# EAGLE design untitled1 (EAGLE 6.1)
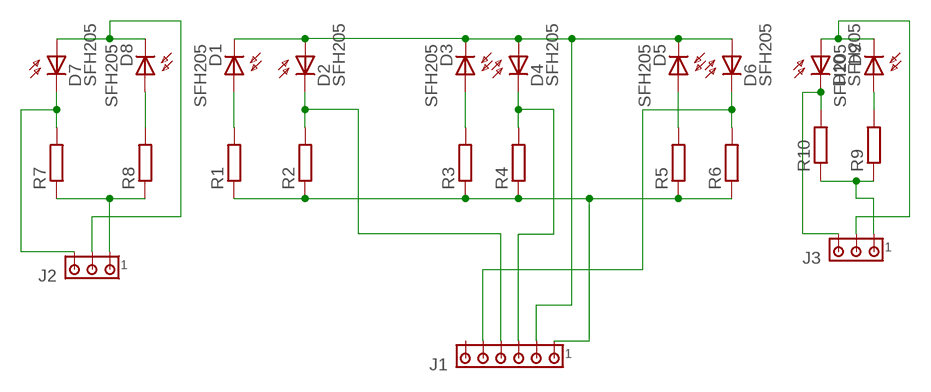
[diagram p0: schematic, sheet 1]

## Parts
D1  SFH205  [SFH205]
D2  SFH205  [SFH205]
D3  SFH205  [SFH205]
D4  SFH205  [SFH205]
D5  SFH205  [SFH205]
D6  SFH205  [SFH205]
D7  SFH205  [SFH205]
D8  SFH205  [SFH205]
D9  SFH205  [SFH205]
D10  SFH205  [SFH205]
J1  MTA06-100  [10X06MTA]
J2  MTA03-100  [10X03MTA]
J3  MTA03-100  [10X03MTA]
R1  R-EU_0207/10  [0207/10]
R2  R-EU_0207/10  [0207/10]
R3  R-EU_0207/10  [0207/10]
R4  R-EU_0207/10  [0207/10]
R5  R-EU_0207/10  [0207/10]
R6  R-EU_0207/10  [0207/10]
R7  R-EU_0207/10  [0207/10]
R8  R-EU_0207/10  [0207/10]
R9  R-EU_0207/10  [0207/10]
R10  R-EU_0207/10  [0207/10]

## Nets
N$1: D1.A R1.2
N$2: D9.K(C) D10.A J3.2
N$3: D3.A R3.2
N$4: D4.K(C) J1.4 R4.2
N$5: D5.A R5.2
N$6: D6.K(C) J1.2 R6.2
N$7: J1.6 R1.1 R2.1 R3.1 R4.1 R5.1 R6.1
N$8: D1.K(C) D2.A D3.K(C) D4.A D5.K(C) D6.A J1.5
N$9: D7.K(C) J2.3 R7.2
N$10: D7.A D8.K(C) J2.2
N$11: D2.K(C) J1.3 R2.2
N$12: D8.A R8.2
N$13: D10.K(C) J3.3 R10.2
N$14: D9.A R9.2
N$15: J2.1 R7.1 R8.1
N$16: J3.1 R9.1 R10.1
Unconnected: J1.1

## Library data of the parts
D1-D10 = opto-trans-siemens:SFH205: PHOTO DIODE; OC_FARNELL: unknown; OC_NEWARK: unknown
J1 = con-amp:MTA06-100: AMP connector
J2 J3 = con-amp:MTA03-100: AMP connector
R1-R10 = rcl:R-EU_: RESISTOR, European symbol

## Board
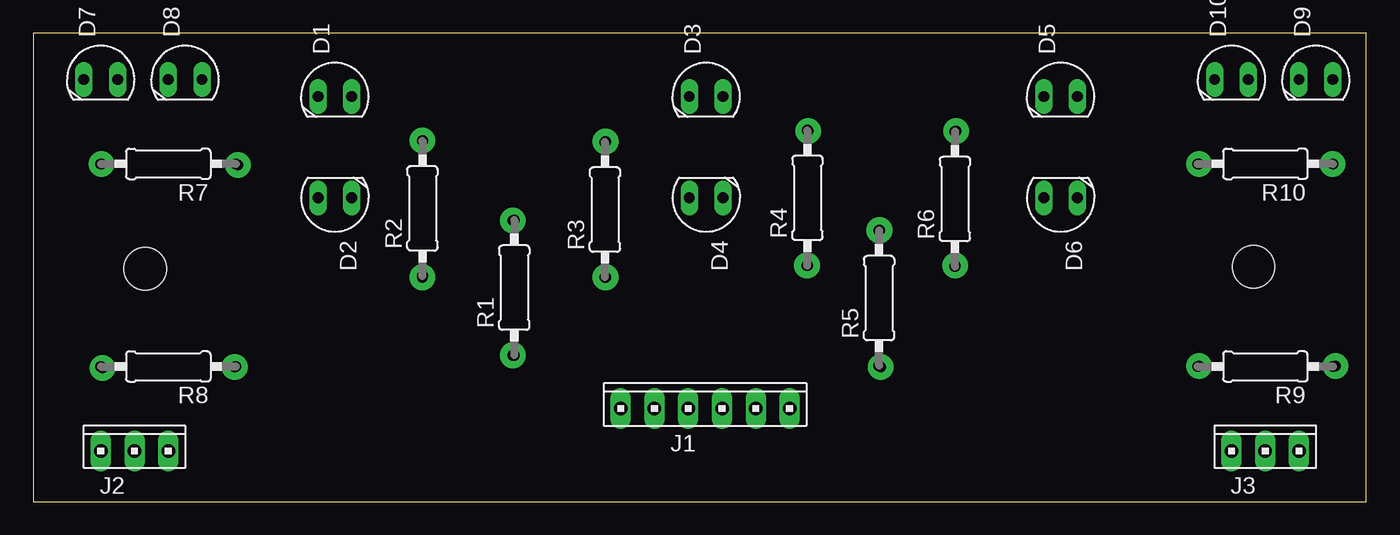
[diagram p1: board, top side]
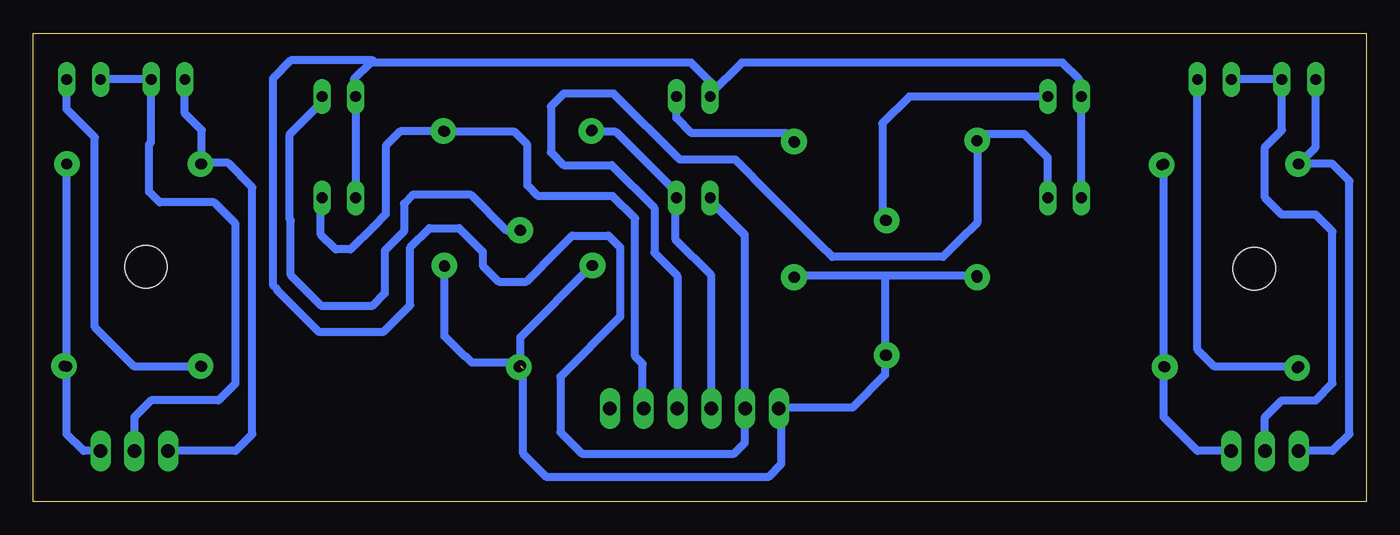
[diagram p2: board, bottom side, seen from below]

Size 100.31 x 35.23 mm. Coordinates in mm from the lower left corner, seen from the top.
Outline: 0,0 100.31,0 100.31,35.23 0,35.23 0,0
Copper layers (1*16): Top 0.035mm / dielectric 1.5mm / Bottom 0.035mm
Design rules: minimum track width 10mil, minimum drill 24mil, track to track 8mil, track to pad 8mil, pad to pad 8mil, via to via 8mil, smd to smd 8mil, copper to edge 40mil, drill to drill 8mil, minimum pad ring 10mil, minimum via ring 8mil, stop-mask expansion 4mil, vias tented up to drill 0mil, thermal gap 10mil
Holes 3.2 mm at 91.83,17.68 8.42,17.52

### Footprints (pad centres in the part's own frame; a part is rotated, then mirrored left to right if it is on the bottom)
SFH205 = drill 0.813 long: A 0,-1.27; K 0,1.27
10X06MTA = drill 1.016 long: 1 6.35,0; 2 3.81,0; 3 1.27,0; 4 -1.27,0; 5 -3.81,0; 6 -6.35,0
10X03MTA = drill 1.016 long: 1 2.54,0; 2 0,0; 3 -2.54,0
0207/10 = drill 0.813 octagon: 1 -5.08,0; 2 5.08,0

### Placement (x,y rotation side)
D1  22.7,30.46 90 top
D2  22.7,22.84 270 top
D3  50.64,30.46 90 top
D4  50.64,22.84 270 top
D5  77.31,30.46 90 top
D6  77.31,22.84 270 top
D7  5.08,31.75 90 top
D8  11.43,31.75 90 top
D9  96.52,31.75 90 top
D10  90.17,31.75 90 top
J1  50.56,6.99 0 top
J2  7.62,3.81 0 top
J3  92.71,3.81 0 top
R1  36.2,16.09 90 top
R2  29.29,22.06 90 top
R3  43.02,21.96 90 top
R4  58.26,22.84 90 top
R5  63.65,15.3 90 top
R6  69.36,22.76 90 top
R7  10.16,25.4 180 top
R8  10.16,10.16 180 top
R9  92.71,10.16 180 top
R10  92.71,25.4 180 top

### Tracks (layer width: path | path; a pad name or v marks a point on that pad's centre or on a via)
N$1
  Bottom 0.61: D1.A 34.39,30.46 36.41,28.45 36.41,21.38 R1.2
N$2
  Bottom 0.61: D9.K D10.A 91.44,27.01 91.59,26.86 91.59,23.3 90.78,22.5 86.7,22.5 85.09,20.89 85.09,8.89 86.36,7.62 91.44,7.62 92.71,6.35 J3.2
N$3
  Bottom 0.61: D3.A 51.91,28.87 50.77,27.72 43.7,27.72 R3.2
N$4
  Bottom 0.61: R4.2 58.14,27.8 56.46,27.8 51.91,23.25 D4.K 52.05,22.7 52.05,22.26 51.97,22.18 51.97,19.69 49.29,17.01 J1.4
N$5
  Bottom 0.61: D5.A 78.58,30.07 81,27.64 81,21.21 80.92,21.13 80.92,17.04 78.59,14.71 74.83,14.71 73.86,15.67 73.86,18.88 72.42,20.33 72.42,22.42 71.78,23.06 67.37,23.06 64.69,20.39 R5.2
N$6
  Bottom 0.61: 78.58,21.84 D6.K 78.68,22.75 78.68,20.09 77.55,18.96 76.43,18.96 74.75,20.65 73.78,21.62 73.78,26.76 72.7,27.84 R6.2 69.31,27.8 64.08,27.8 63.12,26.84 63.12,23.78 62.31,22.98 56.7,22.98 55.02,21.3 55.02,10.93 54.45,10.37 54.45,7.08 J1.2
N$7  (1 unrouted)
  Bottom 0.61: R2.1 36.01,16.98 | 36.01,16.98 42.92,16.98 R3.1 | 36.01,16.98 36.2,16.79 R1.1 36.2,9.53 38.66,7.07 44.13,7.07 J1.6 44.03,6.81 44.03,2.81 44.99,1.85 61.67,1.85 63.44,3.61 63.44,9.72 64.16,10.45 | R6.1 69.36,12.44 67.85,10.93 67.77,10.93 67.29,10.45 64.16,10.45 | 64.16,10.45 63.87,10.45 R5.1 63.65,12.38 R4.1 | 63.36,10.12 63.44,10.04
N$8
  Bottom 0.61: 74.58,33.02 50.8,33.02 49.37,31.59 D3.K 49.37,30.64 46.99,33.02 22.86,33.02 21.59,31.75 21.59,30.62 D1.K D2.A 21.33,22.75 | 74.58,33.02 74.93,33.02 76.2,31.75 76.2,30.62 D5.K D6.A | 46.84,20.09 49.37,22.62 D4.A 49.37,22.7 46.76,20.09 J1.5 46.76,4.42 47.56,3.62 59.03,3.62 60.63,5.22 60.63,9.4 56.14,13.89 56.14,19.12 57.02,20.01 59.75,20.01 60.79,18.97 60.79,18.96 63.2,16.55 65.28,16.55 66.48,17.76 66.48,18.8 68.25,20.57 70.5,20.57 71.94,19.13 71.94,14.79 73.94,12.78 78.84,12.78 81.32,15.27 81.32,15.28 81.33,15.28 81.96,15.91 81.96,15.99 82.28,16.31 82.28,31.82 80.92,33.19 74.75,33.19 74.58,33.02
N$9
  Bottom 0.61: J2.3 2.54,3.81 1.27,5.08 1.27,24.13 2.54,25.4 R7.2 3.81,26.67 D7.K
N$10
  Bottom 0.61: D8.K D7.A 6.35,27.94 7.62,26.67 7.62,22.86 6.35,21.59 3.81,21.59 2.54,20.32 2.54,8.89 3.81,7.62 6.35,7.62 7.62,6.35 J2.2
N$11
  Bottom 0.61: D2.K 23.97,25.87 25.74,27.64 28.78,27.64 R2.2 29.27,27.12 29.27,20.97 30.64,19.61 31.84,18.4 40.18,18.4 41.06,19.28 41.06,19.29 46.12,24.34 46.12,24.35 47.48,25.71 51.65,25.71 56.63,30.7 60.39,30.7 61.35,29.73 61.35,26.27 60.39,25.31 56.79,25.31 53.57,22.1 53.57,18.72 51.83,16.98 J1.3
N$12
  Bottom 0.61: R8.2 11.43,10.16 12.7,11.43 D8.A
N$13
  Bottom 0.61: D10.K 88.9,29.21 87.63,27.94 R10.2 87.56,25.47 85.65,25.47 83.82,23.64 83.82,5.08 85.09,3.81 J3.3
N$14
  Bottom 0.61: R9.2 92.71,10.16 95.68,13.13 95.68,27.4 97.79,29.51 D9.A
N$15
  Bottom 0.61: J2.1 12.7,3.81 15.24,6.35 R8.1 R7.1
N$16
  Bottom 0.61: R10.1 R9.1 97.79,5.08 96.52,3.81 J3.1
N$17  (via drill 0.8 pad 1.93)
  other vias: 5.13,25.39
N$18  (via drill 0.8 pad 1.93)
  other vias: 15.4,25.31
N$19  (via drill 0.8 pad 1.93)
  other vias: 5.21,10.04
N$20  (via drill 0.8 pad 1.93)
  other vias: 15.16,10.12
N$21  (via drill 0.8 pad 1.93)
  other vias: 29.27,27.16
N$22  (via drill 0.8 pad 1.93)
  other vias: 29.27,16.88
N$23  (via drill 0.8 pad 1.93)
  other vias: 36.09,21.13
N$24  (via drill 0.8 pad 1.93)
  other vias: 36.09,11.01
N$25  (via drill 0.8 pad 1.93)
  other vias: 43.07,16.88
N$26  (via drill 0.8 pad 1.93)
  other vias: 43.07,27.08
N$27  (via drill 0.8 pad 1.93)
  other vias: 58.3,27.88
N$28  (via drill 0.8 pad 1.93)
  other vias: 58.22,17.76
N$29  (via drill 0.8 pad 1.93)
  other vias: 63.68,20.41
N$30  (via drill 0.8 pad 1.93)
  other vias: 63.76,10.12
N$31  (via drill 0.8 pad 1.93)
  other vias: 69.37,17.76
N$32  (via drill 0.8 pad 1.93)
  other vias: 69.45,27.88
N$33  (via drill 0.8 pad 1.93)
  other vias: 87.74,25.39
N$34  (via drill 0.8 pad 1.93)
  other vias: 87.74,10.21
N$35  (via drill 0.8 pad 1.93)
  other vias: 98,10.21
N$36  (via drill 0.8 pad 1.93)
  other vias: 97.76,25.39